# Altium project PCB_Project.PrjPcb
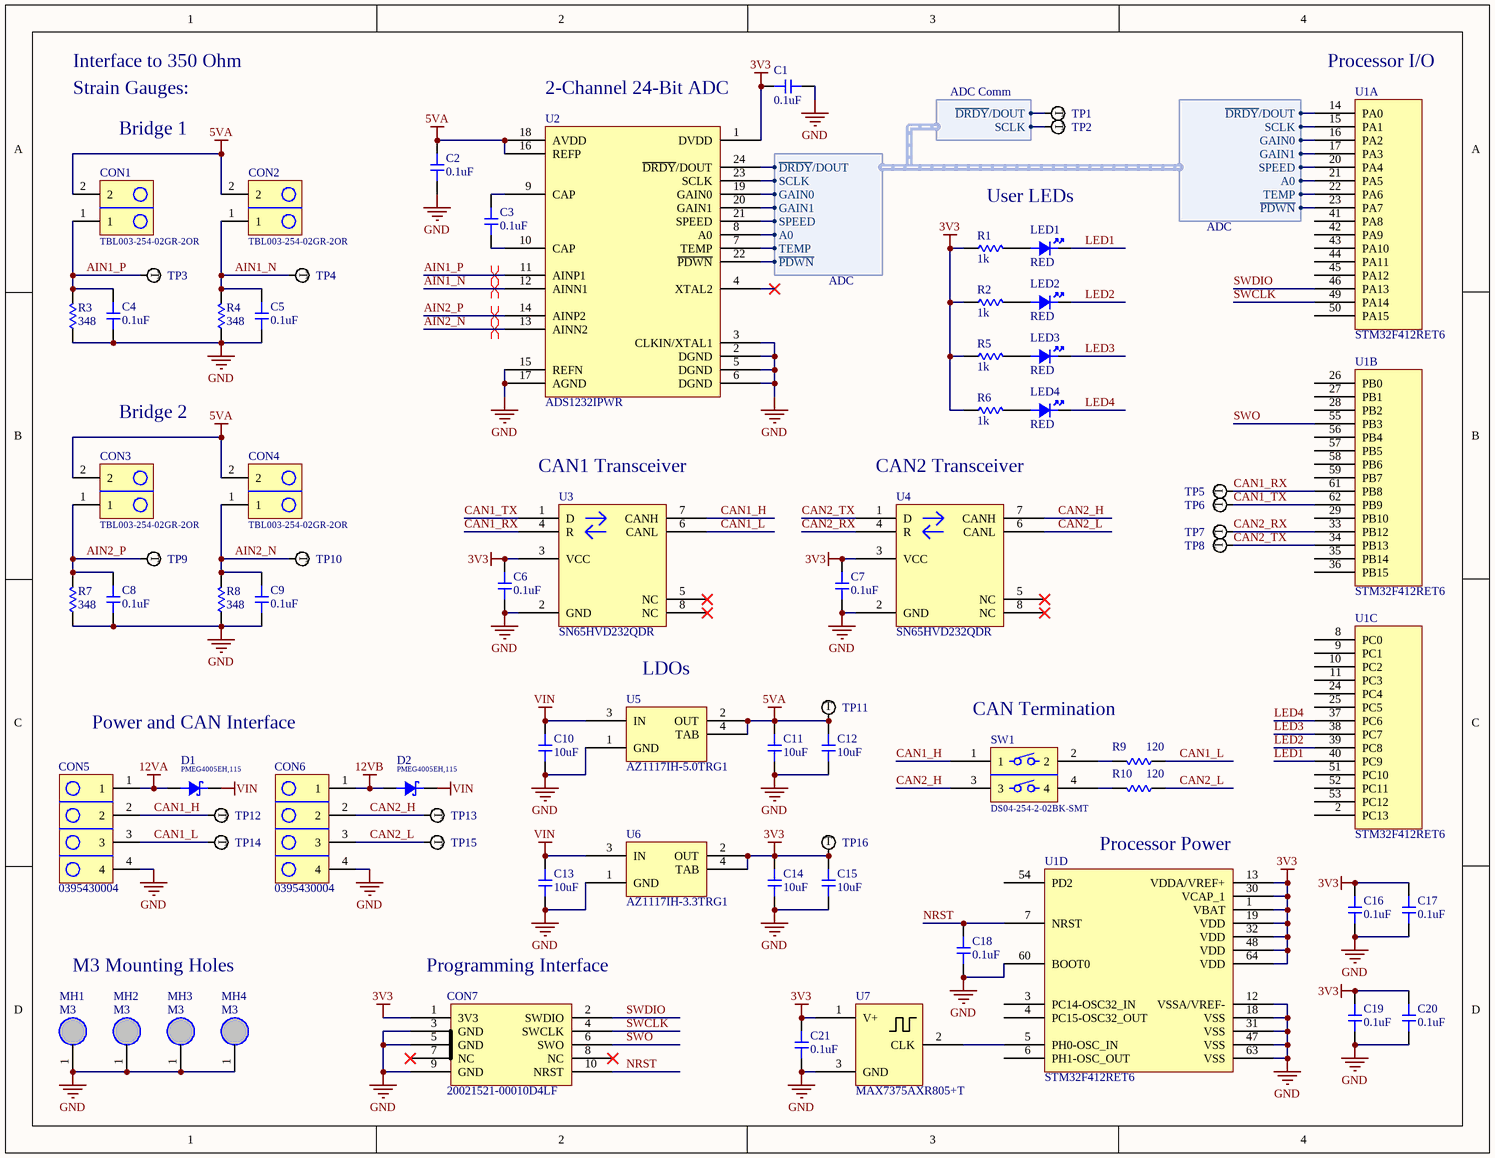
[diagram p0: Schematic.SchDoc]
1 sheet, 72 parts. Net scope: global (net labels, ports and power ports of the same name join across sheets).
Board file: PCB1.PcbDoc

## Sheet Schematic.SchDoc
size Letter; SheetNumber: 1; SheetTotal: 1

### Parts
C1  value 0.1uF  [0603-CAP]  (hidden comment: Capacitor)
C2  value 0.1uF  [0603-CAP]  (hidden comment: Capacitor)
C3  value 0.1uF  [0603-CAP]  (hidden comment: Capacitor)
C4  value 0.1uF  [0603-CAP]  (hidden comment: Capacitor)
C5  value 0.1uF  [0603-CAP]  (hidden comment: Capacitor)
C6  value 0.1uF  [0603-CAP]  (hidden comment: Capacitor)
C7  value 0.1uF  [0603-CAP]  (hidden comment: Capacitor)
C8  value 0.1uF  [0603-CAP]  (hidden comment: Capacitor)
C9  value 0.1uF  [0603-CAP]  (hidden comment: Capacitor)
C10  value 10uF  [0805-CAP]  (hidden comment: Capacitor)
C11  value 10uF  [0805-CAP]  (hidden comment: Capacitor)
C12  value 10uF  [0805-CAP]  (hidden comment: Capacitor)
C13  value 10uF  [0805-CAP]  (hidden comment: Capacitor)
C14  value 10uF  [0805-CAP]  (hidden comment: Capacitor)
C15  value 10uF  [0805-CAP]  (hidden comment: Capacitor)
C16  value 0.1uF  [0603-CAP]  (hidden comment: Capacitor)
C17  value 0.1uF  [0603-CAP]  (hidden comment: Capacitor)
C18  value 0.1uF  [0603-CAP]  (hidden comment: Capacitor)
C19  value 0.1uF  [0603-CAP]  (hidden comment: Capacitor)
C20  value 0.1uF  [0603-CAP]  (hidden comment: Capacitor)
C21  value 0.1uF  [0603-CAP]  (hidden comment: Capacitor)
CON1  TBL003-254-02GR-2OR  [TBL003-254-02GR-2OR]
CON2  TBL003-254-02GR-2OR  [TBL003-254-02GR-2OR]
CON3  TBL003-254-02GR-2OR  [TBL003-254-02GR-2OR]
CON4  TBL003-254-02GR-2OR  [TBL003-254-02GR-2OR]
CON5  0395430004  [0395430004]
CON6  0395430004  [0395430004]
CON7  20021521-00010D4LF  [20021521-00010D4LF]
D1  PMEG4005EH,115  [SODFL350X120-2N]
D2  PMEG4005EH,115  [SODFL350X120-2N]
LED1  value RED  [0603-LED]  (hidden comment: LED)
LED2  value RED  [0603-LED]  (hidden comment: LED)
LED3  value RED  [0603-LED]  (hidden comment: LED)
LED4  value RED  [0603-LED]  (hidden comment: LED)
MH1  M3  [M3_HOLE]  (no BOM)
MH2  M3  [M3_HOLE]  (no BOM)
MH3  M3  [M3_HOLE]  (no BOM)
MH4  M3  [M3_HOLE]  (no BOM)
R1  value 1k  [0603-RES]  (hidden comment: Resistor)
R2  value 1k  [0603-RES]  (hidden comment: Resistor)
R3  value 348  [0603-RES]  (hidden comment: Resistor)
R4  value 348  [0603-RES]  (hidden comment: Resistor)
R5  value 1k  [0603-RES]  (hidden comment: Resistor)
R6  value 1k  [0603-RES]  (hidden comment: Resistor)
R7  value 348  [0603-RES]  (hidden comment: Resistor)
R8  value 348  [0603-RES]  (hidden comment: Resistor)
R9  value 120  [0603-RES]  (hidden comment: Resistor)
R10  value 120  [0603-RES]  (hidden comment: Resistor)
SW1  DS04-254-2-02BK-SMT  [DS04-254-2-02BK-SMT]
TP1  Test Point  [TP_1.6MM]  (value not drawn)
TP2  Test Point  [TP_1.6MM]  (value not drawn)
TP3  Test Point  [TP_1.6MM]  (value not drawn)
TP4  Test Point  [TP_1.6MM]  (value not drawn)
TP5  Test Point  [TP_1.6MM]  (value not drawn)
TP6  Test Point  [TP_1.6MM]  (value not drawn)
TP7  Test Point  [TP_1.6MM]  (value not drawn)
TP8  Test Point  [TP_1.6MM]  (value not drawn)
TP9  Test Point  [TP_1.6MM]  (value not drawn)
TP10  Test Point  [TP_1.6MM]  (value not drawn)
TP11  Test Point  [TP_1.6MM]  (value not drawn)
TP12  Test Point  [TP_1.6MM]  (value not drawn)
TP13  Test Point  [TP_1.6MM]  (value not drawn)
TP14  Test Point  [TP_1.6MM]  (value not drawn)
TP15  Test Point  [TP_1.6MM]  (value not drawn)
TP16  Test Point  [TP_1.6MM]  (value not drawn)
U1  STM32F412RET6  [TSQFP50P1200X1200X160-64N]  (parts A,B,C,D of 4)
U2  ADS1232IPWR  [TSOP65P640X120-24N]
U3  SN65HVD232QDR  [SOIC127P600X175-8N]
U4  SN65HVD232QDR  [SOIC127P600X175-8N]
U5  AZ1117IH-5.0TRG1  [SOT230P700X180-4N]
U6  AZ1117IH-3.3TRG1  [SOT230P700X180-4N]
U7  MAX7375AXR805+T  [SOT65P210X110-3N]

### Harnesses
ADC: ~{DRDY}/DOUT, SCLK, GAIN0, GAIN1, SPEED, A0, TEMP, ~{PDWN}
ADC Comm: ~{DRDY}/DOUT, SCLK

### Nets
3V3: C1.2 C6.1 C7.1 C14.1 C15.1 C16.1 C17.1 C19.1 C20.1 C21.1 CON7.1(3V3) R1.1 R2.1 R5.1 R6.1 TP16.1 U1.1(VBAT) U1.13(VDDA/VREF+) U1.19(VDD) U1.30(VCAP_1) U1.32(VDD) U1.48(VDD) U1.64(VDD) U2.1(DVDD) U3.3(VCC) U4.3(VCC) U6.2(OUT) U6.4(TAB) U7.1(V+)
5VA: C2.2 C11.1 C12.1 CON1.2 CON2.2 CON3.2 CON4.2 TP11.1 U2.16(REFP) U2.18(AVDD) U5.2(OUT) U5.4(TAB)
12VA: CON5.1 D1.2
12VB: CON6.1 D2.2
GND: C1.1 C2.1 C4.2 C5.2 C6.2 C7.2 C8.2 C9.2 C10.2 C11.2 C12.2 C13.2 C14.2 C15.2 C16.2 C17.2 C18.2 C19.2 C20.2 C21.2 CON5.4 CON6.4 CON7.3(GND) CON7.5(GND) CON7.9(GND) MH1.1 MH2.1 MH3.1 MH4.1 R3.1 R4.1 R7.1 R8.1 U1.12(VSSA/VREF-) U1.18(VSS) U1.31(VSS) U1.47(VSS) U1.60(BOOT0) U1.63(VSS) U2.2(DGND) U2.3(CLKIN/XTAL1) U2.5(DGND) U2.6(DGND) U2.15(REFN) U2.17(AGND) U3.2(GND) U4.2(GND) U5.1(GND) U6.1(GND) U7.3(GND)
VIN: C10.1 C13.1 D1.1 D2.1 U5.3(IN) U6.3(IN)
AIN1_N: C5.1 CON2.1 R4.2 TP4.1 U2.12(AINN1)
AIN1_P: C4.1 CON1.1 R3.2 TP3.1 U2.11(AINP1)
AIN2_N: C9.1 CON4.1 R8.2 TP10.1 U2.13(AINN2)
AIN2_P: C8.1 CON3.1 R7.2 TP9.1 U2.14(AINP2)
CAN1_H: CON5.2 SW1.1 TP12.1 U3.7(CANH)
CAN1_L: CON5.3 R9.1 TP14.1 U3.6(CANL)
CAN1_RX: TP5.1 U1.61(PB8) U3.4(R)
CAN1_TX: TP6.1 U1.62(PB9) U3.1(D)
CAN2_H: CON6.2 SW1.3 TP13.1 U4.7(CANH)
CAN2_L: CON6.3 R10.1 TP15.1 U4.6(CANL)
CAN2_RX: TP7.1 U1.33(PB12) U4.4(R)
CAN2_TX: TP8.1 U1.34(PB13) U4.1(D)
LED1: LED1.C U1.40(PC9)
LED2: LED2.C U1.39(PC8)
LED3: LED3.C U1.38(PC7)
LED4: LED4.C U1.37(PC6)
NRST: C18.1 CON7.10(NRST) U1.7(NRST)
SWCLK: CON7.4(SWCLK) U1.49(PA14)
SWDIO: CON7.2(SWDIO) U1.46(PA13)
SWO: CON7.6(SWO) U1.55(PB3)
NetC3_1: C3.1 U2.10(CAP)
NetC3_2: C3.2 U2.9(CAP)
NetLED1_A: LED1.A R1.2
NetLED2_A: LED2.A R2.2
NetLED3_A: LED3.A R5.2
NetLED4_A: LED4.A R6.2
NetR9_2: R9.2 SW1.2
NetR10_2: R10.2 SW1.4
NetTP1_1: TP1.1 U1.14(PA0) U2.24(~{DRDY}/DOUT) ; harness ADC.~{DRDY}/DOUT, harness ADC Comm.~{DRDY}/DOUT
NetTP2_1: TP2.1 U1.15(PA1) U2.23(SCLK) ; harness ADC.SCLK, harness ADC Comm.SCLK
NetU1_5: U1.5(PH0-OSC_IN) U7.2(CLK)
NetU1_16: U1.16(PA2) U2.19(GAIN0) ; harness ADC.GAIN0
NetU1_17: U1.17(PA3) U2.20(GAIN1) ; harness ADC.GAIN1
NetU1_20: U1.20(PA4) U2.21(SPEED) ; harness ADC.SPEED
NetU1_21: U1.21(PA5) U2.8(A0) ; harness ADC.A0
NetU1_22: U1.22(PA6) U2.7(TEMP) ; harness ADC.TEMP
NetU1_23: U1.23(PA7) U2.22(~{PDWN}) ; harness ADC.~{PDWN}

Not connected (* = marked no-connect by the designer): CON7 7(NC)* 8(NC)*; U1 2(PC13) 3(PC14-OSC32_IN) 4(PC15-OSC32_OUT) 6(PH1-OSC_OUT) 8(PC0) 9(PC1) 10(PC2) 11(PC3) 24(PC4) 25(PC5) 26(PB0) 27(PB1) 28(PB2) 29(PB10) 35(PB14) 36(PB15) 41(PA8) 42(PA9) 43(PA10) 44(PA11) 45(PA12) 50(PA15) 51(PC10) 52(PC11) 53(PC12) 54(PD2) 56(PB4) 57(PB5) 58(PB6) 59(PB7); U2 4(XTAL2)*; U3 5(NC)* 8(NC)*; U4 5(NC)* 8(NC)*

### Layout directives
differential pair: AIN1_N, AIN1_P, AIN2_N, AIN2_P

### Notes on the sheet
- Interface to 350 Ohm
- Strain Gauges:
- 2-Channel 24-Bit ADC
- (near U1) Processor I/O
- Bridge 1
- User LEDs
- Bridge 2
- (near U3) CAN1 Transceiver
- CAN2 Transceiver
- LDOs
- Power and CAN Interface
- CAN Termination
- (near U1) Processor Power
- M3 Mounting Holes
- Programming Interface
- (in symbol Test Point) T

### Library data of the parts
CON1-CON4 = TBL003-254-02GR-2OR: TERMINAL BLOCK, SCREWLESS, 2.54,; Supplier 1: Digi-Key; Supplier Part Number 1: 102-6385-ND
CON5 CON6 = 0395430004: TERM BLK 4POS SIDE ENTRY 5MM PCB; Supplier 1: Digi-Key; Supplier Part Number 1: WM13967-ND
CON7 = 20021521-00010D4LF: CONN HEADER SMD 10POS 1.27MM; Supplier 1: Digi-Key; Supplier Part Number 1: 609-6533-ND
D1 D2 = PMEG4005EH,115: DIODE SCHOTTKY 40V 500MA SOD123F; Supplier 1: Digi-Key; Supplier Part Number 1: 1727-3876-1-ND
MH1-MH4 = M3_HOLE: M3 MOUNTING HOLE
SW1 = DS04-254-2-02BK-SMT: DIP SWITCH, SPST, 2.54 PITCH, FL; Supplier Part Number 1: 2223-DS04-254-2-02BK-SMT-ND; Supplier 1: Digi-Key
U1 = STM32F412RET6: IC MCU 32BIT 512KB FLASH 64LQFP; Supplier 1: Digi-Key; Supplier Part Number 1: 497-18546-ND
U2 = ADS1232IPWR: IC ADC 24BIT SIGMA-DELTA 24TSSOP; Supplier 1: Digi-Key; Supplier Part Number 1: 296-25894-1-ND
U3 U4 = SN65HVD232QDR: IC TRANSCEIVER HALF 1/1 8SOIC; Supplier 1: Digi-Key; Supplier Part Number 1: 296-52699-1-ND
U5 = AZ1117IH-5.0TRG1: IC REG LINEAR 5V 1A SOT223; Supplier 1: Digi-Key; Supplier Part Number 1: AZ1117IH-5.0TRG1DICT-ND
U6 = AZ1117IH-3.3TRG1: IC REG LINEAR 3.3V 1A SOT223; Supplier 1: Digi-Key; Supplier Part Number 1: AZ1117IH-3.3TRG1DICT-ND
U7 = MAX7375AXR805+T: MEMS OSC XO 8.0000MHZ CMOS SMD; Supplier 1: Digi-Key; Supplier Part Number 1: MAX7375AXR805+TCT-ND
C1-C21 = Capacitor: Supplier 1: Digi-Key
  C1-C9 C16-C21: Supplier Part Number 1: 732-7965-1-ND
  C10-C15: Supplier Part Number 1: 1276-2891-1-ND
LED1-LED4 = LED: Supplier 1: Digi-Key; Supplier Part Number 1: 732-4978-1-ND
R1-R10 = Resistor: Supplier 1: Digi-Key
  R1 R2 R5 R6: Supplier Part Number 1: 311-1KLDCT-ND
  R3 R4 R7 R8: Supplier Part Number 1: YAG4536CT-ND
  R9 R10: Supplier Part Number 1: 311-120HRCT-ND
TP1-TP16 = Test Point: Supplier 1: Digi-Key; Supplier Part Number 1: 36-5120-ND